# EAGLE schematic telemetry-r1 (EAGLE 7.6.0)
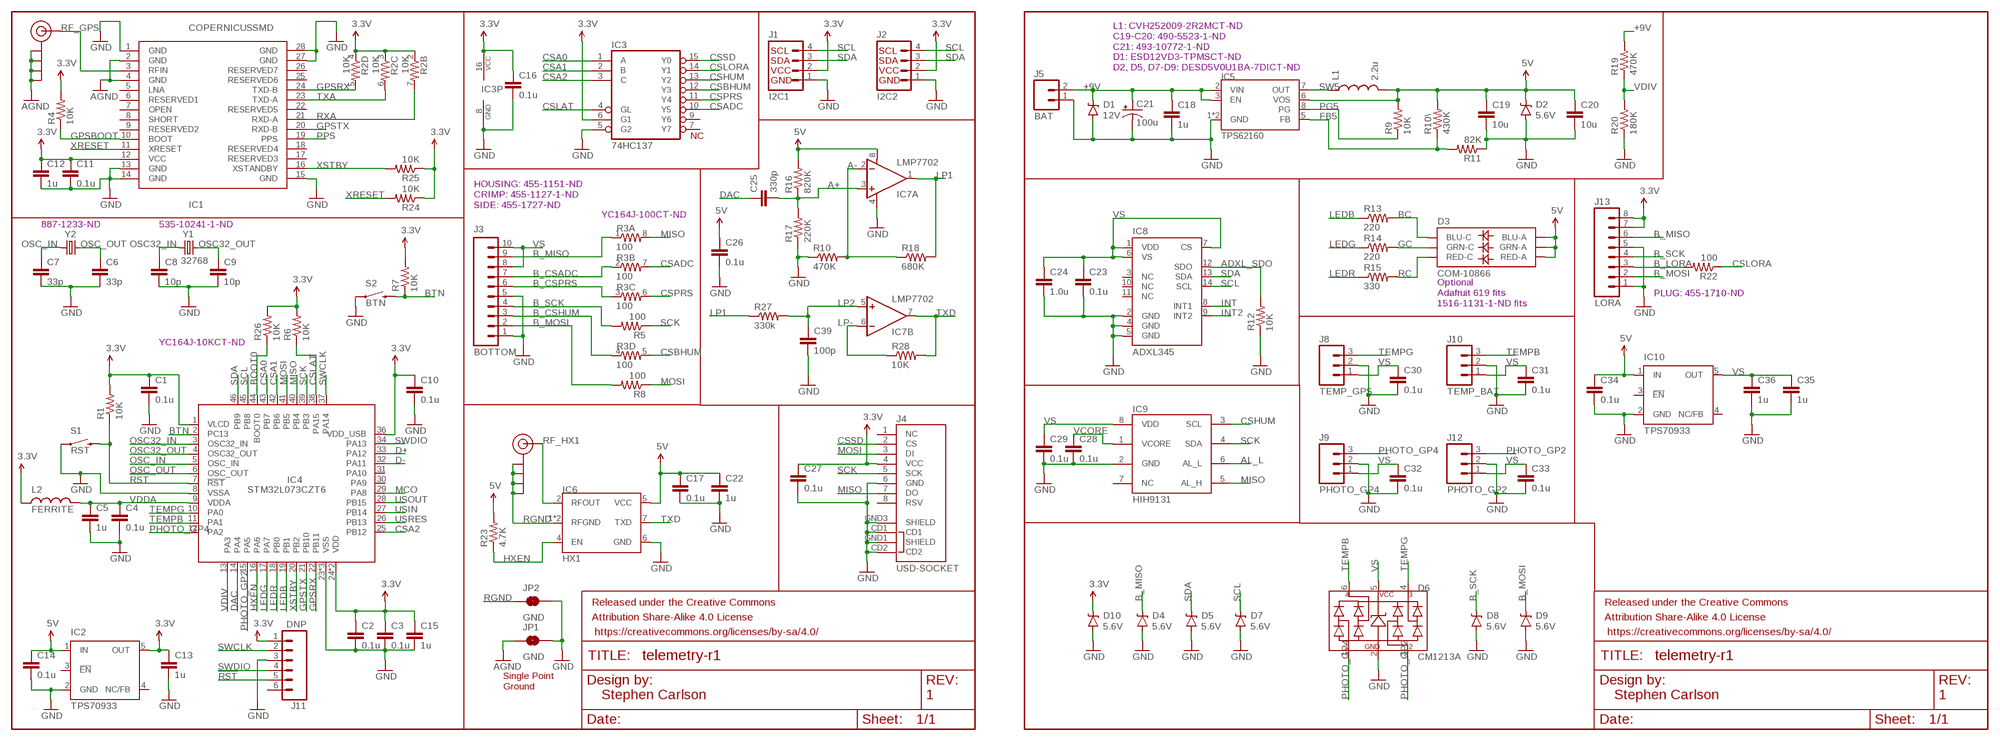
[diagram p0: schematic, sheet 1]

## Parts
C1  0.1u  CAP0805  [0805]
C2  0.1u  CAP0805  [0805]
C3  0.1u  CAP0805  [0805]
C4  0.1u  CAP0805  [0805]
C5  1u  CAP0805  [0805]
C6  33p  CAP0805  [0805]
C7  33p  CAP0805  [0805]
C8  10p  CAP0805  [0805]
C9  10p  CAP0805  [0805]
C10  0.1u  CAP0805  [0805]
C11  0.1u  CAP0805  [0805]
C12  1u  CAP0805  [0805]
C13  1u  CAP0805  [0805]
C14  0.1u  CAP0805  [0805]
C15  1u  CAP0805  [0805]
C16  0.1u  CAP0805  [0805]
C17  0.1u  CAP0805  [0805]
C18  1u  CAP0805  [0805]
C19  10u  CAP0805  [0805]
C20  10u  CAP0805  [0805]
C21  100u  CAP_POLPTH2  [CPOL-RADIAL-10UF-25V]
C22  1u  CAP0805  [0805]
C23  0.1u  CAP0805  [0805]
C24  1.0u  CAP0805  [0805]
C25  330p  CAP0805  [0805]
C26  0.1u  CAP0805  [0805]
C27  0.1u  CAP0805  [0805]
C28  0.1u  CAP0805  [0805]
C29  0.1u  CAP0805  [0805]
C30  0.1u  CAP0805  [0805]
C31  0.1u  CAP0805  [0805]
C32  0.1u  CAP0805  [0805]
C33  0.1u  CAP0805  [0805]
C34  0.1u  CAP0805  [0805]
C35  1u  CAP0805  [0805]
C36  1u  CAP0805  [0805]
C39  100p  CAP0805  [0805]
D1  12V  DIODE-ZENER5.6V  [SOD-323]
D2  5.6V  DIODE-ZENER5.6V  [SOD-323]
D3  COM-10866  LED-TRICOLOR-5050NO_IC  [LED-TRICOLOR-5050]
D4  5.6V  DIODE-ZENER5.6V  [SOD-323]
D5  5.6V  DIODE-ZENER5.6V  [SOD-323]
D6  CM1213A  [SC70-6L]
D7  5.6V  DIODE-ZENER5.6V  [SOD-323]
D8  5.6V  DIODE-ZENER5.6V  [SOD-323]
D9  5.6V  DIODE-ZENER5.6V  [SOD-323]
D10  5.6V  DIODE-ZENER5.6V  [SOD-323]
FRAME1  FRAME-LETTERNO_PACKAGE  [DUMMY]
FRAME2  FRAME-LETTERNO_PACKAGE  [DUMMY]
IC1  COPERNICUSSMD  [COPERNICUS]
IC2  TPS70933  TPS77033  [SOT23-DBV]
IC3  74HC137  74LS137PW  [TSSOP16]
IC4  STM32L073CZT6  STM32L07C  [TQFP48]
IC5  TPS62160  [MSOP8]
IC6  HX1  [HX1]
IC7  LMP7702  OPAMP-DUALU  [SO08]
IC8  ADXL345  [LGA14]
IC9  HIH9131  HIH6131  [SOIC8]
IC10  TPS70933  TPS77033  [SOT23-DBV]
J1  I2C1  I2C_STANDARD_NO_SILK  [1X04_NO_SILK]
J2  I2C2  I2C_STANDARD_NO_SILK  [1X04_NO_SILK]
J3  BOTTOM  M102MM  [1X10-2MM]
J4  USD-SOCKET  [MICROSD_1:1]
J5  BAT  M02PTH  [1X02]
J6  SMA_EDGE  [SMA-EDGE]
J7  SMA_EDGE  [SMA-EDGE]
J8  TEMP_GPS  M03JST-PTH  [JST-3-PTH]
J9  PHOTO_GP4  M03JST-PTH  [JST-3-PTH]
J10  TEMP_BAT  M03JST-PTH  [JST-3-PTH]
J11  DNP  M06LOCK  [1X06_LOCK]
J12  PHOTO_GP2  M03JST-PTH  [JST-3-PTH]
J13  LORA  1X08  [1X08-2MM]
JP1  GND  JUMPER-PAD-2-NC_BY_TRACE  [PAD-JUMPER-2-NC_BY_TRACE_YES_SILK]
JP2  GND  JUMPER-PAD-2-NC_BY_TRACE  [PAD-JUMPER-2-NC_BY_TRACE_YES_SILK]
L1  2.2u  INDUCTOR1008  [1008]
L2  FERRITE  INDUCTOR1206  [1206]
R1  10K  RESISTOR0805-RES  [0805]
R2  10K  RESISTOR-ARRAY0603-ARV  [0603-ARV]
R3  100  RESISTOR-ARRAY0603-ARV  [0603-ARV]
R4  10K  RESISTOR0805-RES  [0805]
R5  100  RESISTOR0805-RES  [0805]
R6  10K  RESISTOR0805-RES  [0805]
R7  10K  RESISTOR0805-RES  [0805]
R8  100  RESISTOR0805-RES  [0805]
R9  10K  RESISTOR0805-RES  [0805]
R10  470K  RESISTOR0805-RES  [0805]
R10\  430K  RESISTOR0805-RES  [0805]
R11  82K  RESISTOR0805-RES  [0805]
R12  10K  RESISTOR0805-RES  [0805]
R13  220  RESISTOR0805-RES  [0805]
R14  220  RESISTOR0805-RES  [0805]
R15  330  RESISTOR0805-RES  [0805]
R16  820K  RESISTOR0805-RES  [0805]
R17  220K  RESISTOR0805-RES  [0805]
R18  680K  RESISTOR0805-RES  [0805]
R19  470K  RESISTOR0805-RES  [0805]
R20  180K  RESISTOR0805-RES  [0805]
R22  100  RESISTOR0805-RES  [0805]
R23  4.7K  RESISTOR0805-RES  [0805]
R24  10K  RESISTOR0805-RES  [0805]
R25  10K  RESISTOR0805-RES  [0805]
R26  10K  RESISTOR0805-RES  [0805]
R27  330k  RESISTOR0805-RES  [0805]
R28  10K  RESISTOR0805-RES  [0805]
S1  RST  SWITCH  [TACTILE-PTH-THIN]
S2  BTN  SWITCH  [TACTILE-PTH-THIN]
Y1  32768  CRYSTAL  [ABS25]
Y2  8M  CRYSTALSMD  [HC49UP]

## Nets
3.3V: C1.1 C2.1 C3.1 C10.1 C11.1 C12.1 C13.1 C15.1 C16.1 C27.1 D10.C IC1.12(VCC) IC2.5(OUT) IC3.6(G1) IC3.16(VCC) IC4.1(VLCD) IC4.24(VDD) IC4.36(VDD_USB) IC4.48(VDD) J1.2 J2.2 J4.4(VCC) J11.1 J13.7 J13.8 L2.1 R1.2 R2.2 R2.3 R2.4 R4.2 R6.2 R7.2 R24.1 R25.1 R26.2
5V: C14.1 C17.1 C19.1 C20.1 C22.1 C26.1 C34.1 D2.C D3.1(GRN-A) D3.2(RED-A) D3.3(BLU-A) IC2.1(IN) IC5.6(VOS) IC6.5(VCC) IC7.8(A:V+) IC10.1(IN) L1.2 R9.2 R10\.2 R16.2 R23.2
!RST!: IC4.7(!RST!) J11.5 R1.1 S1.2
+9V: C18.1 C21.1(+) D1.C IC5.2(VIN) IC5.3(EN) J5.2 R19.2
A+: C25.2 IC7.3(A:+IN) R16.1 R17.2
A-: IC7.2(A:-IN) R10.2 R18.1
ADXL_SDO: IC8.12(SDO) R12.2
AGND: IC1.2(GND) IC1.4(GND) J7.GND@0(GND) J7.GND@1(GND) J7.GND@2(GND) J7.GND@3(GND) JP1.1
AL_L: IC9.6(AL_L)
B_CSADC: J3.7 R3.2
B_CSHUM: J3.3 R3.4
B_CSPRS: J3.6 R3.3
B_LORA: J13.3 R22.2
B_MISO: D4.C J3.9 J13.6 R3.1
B_MOSI: D9.C J3.2 J13.2 R8.2
B_SCK: D8.C J3.4 J13.4 R5.2
BC: D3.4(BLU-C) R13.2
BOOT0: IC4.44(BOOT0) R26.1
BTN: IC4.2(PC13) R7.1 S2.2
CSA0: IC3.1(A) IC4.43(PB7)
CSA1: IC3.2(B) IC4.42(PB6)
CSA2: IC3.3(C) IC4.25(PB12)
CSADC: IC3.10(Y5) R3.7
CSBHUM: IC3.12(Y3) R3.5
CSHUM: IC3.13(Y2) IC9.3(SCL)
CSLAT: IC3.4(GL) IC4.38(PA15) R6.1
CSLORA: IC3.14(Y1) R22.1
CSPRS: IC3.11(Y4) R3.6
CSSD: IC3.15(Y0) J4.2(CS)
D+: IC4.33(PA12)
D-: IC4.32(PA11)
DAC: C25.1 IC4.14(PA4)
FB5: IC5.5(FB) R10\.1 R11.2
GC: D3.6(GRN-C) R14.2
GND: C1.2 C2.2 C3.2 C4.2 C5.2 C6.2 C7.2 C8.2 C9.2 C10.2 C11.2 C12.2 C13.2 C14.2 C15.2 C16.2 C17.2 C18.2 C19.2 C20.2 C21.2(-) C22.2 C23.2 C24.2 C26.2 C27.2 C28.2 C29.2 C30.2 C31.2 C32.2 C33.2 C34.2 C35.2 C36.2 C39.2 D1.A D2.A D4.A D5.A D6.2(GND) D7.A D8.A D9.A D10.A IC1.1(GND) IC1.13(GND) IC1.14(GND) IC1.15(GND) IC1.27(GND) IC1.28(GND) IC2.2(GND) IC3.5(G2) IC3.8(GND) IC4.8(VSSA) IC4.23(VSS) IC4.35(VSS) IC4.47(VSS) IC5.1(GND) IC5.4(GND) IC6.6(GND) IC7.4(A:V-) IC8.2(GND) IC8.4(GND) IC8.5(GND) IC9.2(GND) IC10.2(GND) J1.1 J2.1 J3.1 J3.5 J4.6(GND) J4.CD1 J4.CD2 J4.GND1(SHIELD) J4.GND3(SHIELD) J5.1 J8.2 J9.2 J10.2 J11.3 J12.2 J13.1 J13.5 JP1.2 JP2.2 R10.1 R11.1 R12.1 R17.1 R20.1 S1.1 S2.1
GPSBOOT: IC1.10(BOOT) R4.1
GPSRX: IC1.24(TXD-B) IC4.22(PB11) R2.5
GPSTX: IC1.20(RXD-B) IC4.21(PB10)
HXEN: IC4.16(PA6) IC6.4(EN) R23.1
INT: IC8.8(INT1)
INT2: IC8.9(INT2)
LEDB: IC4.19(PB1) R13.1
LEDG: IC4.17(PA7) R14.1
LEDR: IC4.18(PB0) R15.1
LP1: IC7.1(A:OUT) R18.2 R27.1
LP2: C39.1 IC7.5(B:+IN) R27.2
LP-: IC7.6(B:-IN) R28.1
MCO: IC4.29(PA8)
MISO: IC4.40(PB4) IC9.5(AL_H) J4.7(DO) R3.8
MOSI: IC4.41(PB5) J4.3(DI) R8.1
OSC32_IN: C8.1 IC4.3(OSC32_IN) Y1.1
OSC32_OUT: C9.1 IC4.4(OSC32_OUT) Y1.4
OSC_IN: C7.1 IC4.5(OSC_IN) Y2.1
OSC_OUT: C6.1 IC4.6(OSC_OUT) Y2.2
PG5: IC5.8(PG) R9.1
PHOTO_GP2: D6.3(CH2) IC4.15(PA5) J12.3
PHOTO_GP4: D6.1(CH1) IC4.12(PA2) J9.3
PPS: IC1.19(PPS)
RC: D3.5(RED-C) R15.2
RF_GPS: IC1.3(RFIN) J7.SIG(SIGNAL)
RF_HX1: IC6.2(RFOUT) J6.SIG(SIGNAL)
RGND: IC6.1(RFGND) IC6.3(RFGND) J6.GND@0(GND) J6.GND@1(GND) J6.GND@2(GND) J6.GND@3(GND) JP2.1
RXA: IC1.21(RXD-A) R2.7
SCK: IC4.39(PB3) IC9.4(SDA) J4.5(SCK) R5.1
SCL: D7.C IC4.45(PB8) IC8.14(SCL) J1.4 J2.4
SDA: D5.C IC4.46(PB9) IC8.13(SDA) J1.3 J2.3
SW5: IC5.7(OUT) L1.1
SWCLK: IC4.37(PA14) J11.2
SWDIO: IC4.34(PA13) J11.4
TEMPB: D6.6(CH4) IC4.11(PA1) J10.3
TEMPG: D6.4(CH3) IC4.10(PA0) J8.3
TXA: IC1.23(TXD-A) R2.6
TXD: IC6.7(TXD) IC7.7(B:OUT) R28.2
USIN: IC4.27(PB14)
USOUT: IC4.28(PB15)
USRES: IC4.26(PB13)
VCORE: C28.1 IC9.1(VCORE)
VDDA: C4.1 C5.1 IC4.9(VDDA) L2.2
VDIV: IC4.13(PA3) R19.1 R20.2
VS: C23.1 C24.1 C29.1 C30.1 C31.1 C32.1 C33.1 C35.1 C36.1 D6.5(VCC) IC8.1(VDD) IC8.6(VS) IC8.7(CS) IC9.8(VDD) IC10.5(OUT) J3.8 J3.10 J8.1 J9.1 J10.1 J12.1
XRESET: IC1.11(XRESET) R24.2
XSTBY: IC1.16(XSTANDBY) IC4.20(PB2) R25.2
Unconnected: IC1.5(LNA) IC1.6(RESERVED1) IC1.7(OPEN) IC1.8(SHORT) IC1.9(RESERVED2) IC1.17(RESERVED3) IC1.18(RESERVED4) IC1.22(RESERVED5) IC1.25(RESERVED6) IC1.26(RESERVED7) IC2.3(!EN) IC2.4(NC/FB) IC3.7(Y7) IC3.9(Y6) IC4.30(PA9) IC4.31(PA10) IC8.3(NC) IC8.10(NC) IC8.11(NC) IC9.7(NC) IC10.3(!EN) IC10.4(NC/FB) J4.1(NC) J4.8(RSV) J11.6 R2.1 R2.8

## Notes on the sheet
- L1: CVH252009-2R2MCT-ND
  C19-C20: 490-5523-1-ND
  C21: 493-10772-1-ND
  D1: ESD12VD3-TPMSCT-ND
  D2, D5, D7-D9: DESD5V0U1BA-7DICT-ND
- NC
- HOUSING: 455-1151-ND
  CRIMP: 455-1127-1-ND
  SIDE: 455-1727-ND
- YC164J-100CT-ND
- 887-1233-ND | 535-10241-1-ND
- PLUG: 455-1710-ND
- Optional
  Adafruit 619 fits
  1516-1131-1-ND fits
- YC164J-10KCT-ND
- Single Point
  Ground
- Stephen Carlson | 1 | Stephen Carlson | 1

## Library data of the parts
C1-C20 C22-C36 C39 = SparkFun-Passives:CAP: Capacitor Standard 0603 ceramic capacitor, and 0.1" leaded capacitor.
C21 = SparkFun-Passives:CAP_POL: Capacitor Polarized These are standard SMD and PTH capacitors. Normally 10uF, 47uF, and 100uF in electrolytic and tantalum varieties. Always verify the external diameter of the through hole cap, it varies with capacity, voltage, and manufacturer. The EIA devices should be standard.
D1 = SparkFun-DiscreteSemi:DIODE-ZENER: Zener Diode Production Part - 8199 3.4V Zener Voltage; PROD_ID: DIO-12442; VALUE: 5.6V
D2 D4 D5 D7-D10 = SparkFun-DiscreteSemi:DIODE-ZENER: Zener Diode Production Part - 8199 3.4V Zener Voltage; PROD_ID: DIO-12442
D3 = SparkFun-LED:LED-TRICOLOR-5050
D6 = HAB:CM1213A: CM1213A CM1213A 4-channel ESD protection device
FRAME1 FRAME2 = SparkFun-Aesthetics:FRAME-LETTER: Schematic Frame Standard 8.5x11 US Letter frame; DESIGNER: Nobody; VERSION: v01
IC1 = SparkFun-RF:COPERNICUS: Copernicus II GPS- Trimble recommended layout and paste layer. Footprint production proven. Spark Fun Electronics SKU : GPS-07951
IC2 IC10 = texas:TPS770*: ULTRALOW-POWER 50-mA LOW-DROPOUT LINEAR REGULATORS 50-mA Low-Dropout Regulator Source: http://focus.ti.com/lit/ds/symlink/tps77001.pdf; MF: TEXAS INSTRUMENTS; MPN: TPS77033DBVT; OC_FARNELL: 8461570; OC_NEWARK: 77C1187
IC3 = HAB:74*137: 3-line to 8-line DECODER/DEMULTIPLEXER, address LATCH
IC4 = stm32xx:STM32L07*C: STM32L07XC STM32L07X series in LQFP-48 package
IC5 = HAB:TPS62160: TPS62160 Adjustable switch-mode D-CAP2 regulator
IC6 = HAB:HX1: Radiometrix HX1 High-power VHF Narrow Band 300 mW Transmitter
IC7 = SparkFun-AnalogIC:OPAMP-DUAL: Generic op-amp footprint
IC8 = SparkFun-Sensors:ADXL345: 3-axis SPI/I2C 2/4/8/16g accelerometer
IC9 = SparkFun-AnalogIC:HIH6131
J1 J2 = SparkFun-Connectors:I2C_STANDARD: SparkFun has standardized on a pinout for all I2C based sensor breakouts. This pinout allows I2C boards to be plugged directly into the headers on Arduino Uno compatible boards, and to be daisy chained easily.
J3 = SparkFun-Connectors:M10: Header 10 Standard 10-pin 0.1" header. Use with straight break away headers (SKU : PRT-00116), right angle break away headers (PRT-00553), swiss pins (PRT-00743), machine pins (PRT-00117), and female headers (PRT-00115).
J4 = SparkFun-Connectors:USD-SOCKET: microSD Socket Push-push type uSD socket. Schematic element and footprint production proven. Spark Fun Electronics SKU : PRT-00127. tDoc lines correctly indicate media card edge positions when inserting (unlocked, locked, depressed). NOTE: CD1 and CD2 are connected internally; PROD_ID: CONN-07820
J5 = SparkFun-Connectors:M02: Standard 2-pin 0.1" header. Use with - straight break away headers ( PRT-00116) - right angle break away headers (PRT-00553) - swiss pins (PRT-00743) - machine pins (PRT-00117) - female headers (PRT-00115) Molex polarized connector foot print use with: PRT-08233 with associated crimp pins and housings. 2.54_SCREWTERM for use with PRT-10571. 3.5mm Screw Terminal footprints for PRT-08084 5mm Screw Terminal footprints for use with PRT-08432
J6 J7 = SparkFun-Connectors:SMA_EDGE: SMA Antenna Connector End launch SMA connector. The paste layer has been removed so that the connector can be hand soldered onto the board after reflow.
J8-J10 J12 = SparkFun-Connectors:M03: Header 3 Standard 3-pin 0.1" header. Use with straight break away headers (SKU : PRT-00116), right angle break away headers (PRT-00553), swiss pins (PRT-00743), machine pins (PRT-00117), and female headers (PRT-00115). Molex polarized connector foot print use with SKU : PRT-08232 with associated crimp pins and housings.; SKU: PRT-09915
J11 = SparkFun-Connectors:M06: Header 6 Standard 6-pin 0.1" header. Use with straight break away headers (SKU : PRT-00116), right angle break away headers (PRT-00553), swiss pins (PRT-00743), machine pins (PRT-00117), and female headers (PRT-00115). Molex polarized connector foot print use with SKU : PRT-08094 with associated crimp pins and housings. NOTES ON THE VARIANTS LOCK and LOCK_LONGPADS... This footprint was designed to help hold the alignment of a through-hole component (i.e. 6-pin header) while soldering it into place. You may notice that each hole has been shifted either up or down by 0.005 of an inch from it's more standard position (which is a perfectly straight line). This slight alteration caused the pins (the squares in the middle) to touch the edges of the holes. Because they are alternating, it causes a "brace" to hold the component in place. 0.005 has proven to be the perfect amount of "off-center" position when using our standard breakaway headers. Although looks a little odd when you look at the bare footprint, once you have a header in there, the alteration is very hard to notice. Also,if you push a header all the way into place, it is covered up entirely on the bottom side. This idea of altering the position of holes to aid alignment will be further integrated into the Sparkfun Library for other footprints. It can help hold any component with 3 or more connection pins.
J13 = HAB:1X08: 1X08 1x8 header
JP1 JP2 = SparkFun-Passives:JUMPER-PAD-2-NC_BY_TRACE
L1 L2 = HAB:INDUCTOR: INDUCTOR Standard inductor, with some new packages Why do inductors never come in standard packages!?
R1 R4-R10 R10\ R11-R20 R22-R28 = SparkFun-Passives:RESISTOR: Resistor Basic schematic elements and footprints for 0603, 1206, and PTH resistors.
R2 R3 = SparkFun-Passives:RESISTOR-ARRAY: Array Chip Resistor Source: RS Component / Phycomp
S1 S2 = HAB:SWITCH: SWITCH Package for the MJTP1250, a thinner and lighter PTH push button switch.
Y1 = HAB:CRYSTAL: CRYSTAL Crystal oscillators in packages not in SparkFun-FreqCtl
Y2 = SparkFun-FreqCtrl:CRYSTAL: Various standard crystals. Proven footprints.